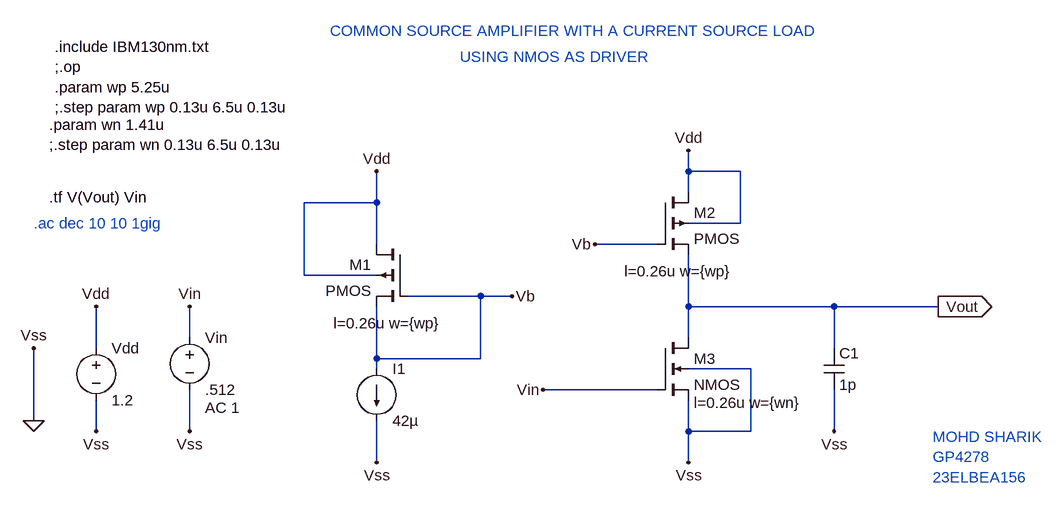
[diagram p0: schematic CSA_WITH_CURRENT_LOAD_ASSIGNMENT1.asc]
CSA_WITH_CURRENT_LOAD_ASSIGNMENT1.asc, the LTspice schematic file:
Version 4
SHEET 1 1208 680
WIRE 528 -112 528 -144
WIRE 608 -112 528 -112
WIRE 528 -80 528 -112
WIRE 48 -64 48 -112
WIRE 48 -64 -64 -64
WIRE 608 -32 608 -112
WIRE 608 -32 528 -32
WIRE 48 0 48 -64
WIRE 480 0 384 0
WIRE -64 48 -64 -64
WIRE 48 48 -64 48
WIRE 208 80 96 80
WIRE 256 80 208 80
WIRE 528 96 528 16
WIRE 752 96 528 96
WIRE 912 96 752 96
WIRE -240 144 -240 96
WIRE 528 144 528 96
WIRE -384 160 -384 96
WIRE 752 160 752 96
WIRE 48 176 48 96
WIRE 208 176 208 80
WIRE 208 176 48 176
WIRE 48 192 48 176
WIRE 624 192 528 192
WIRE 480 224 304 224
WIRE -480 272 -480 160
WIRE -384 288 -384 240
WIRE -240 288 -240 224
WIRE 528 288 528 240
WIRE 624 288 624 192
WIRE 624 288 528 288
WIRE 752 288 752 224
WIRE 48 336 48 272
WIRE 528 336 528 288
FLAG -480 272 0
FLAG 48 -112 Vdd
FLAG -384 96 Vdd
FLAG -480 160 Vss
FLAG -384 288 Vss
FLAG 48 336 Vss
FLAG 256 80 Vb
FLAG 752 288 Vss
FLAG 528 336 Vss
FLAG 912 96 Vout
IOPIN 912 96 Out
FLAG 384 0 Vb
FLAG 304 224 Vin
FLAG 528 -144 Vdd
FLAG -240 288 Vss
FLAG -240 96 Vin
SYMBOL pmos4 96 0 M0
WINDOW 123 -51 122 Left 2
SYMATTR Value2 l=0.26u w={wp}
SYMATTR InstName M1
SYMBOL current 48 192 R0
WINDOW 123 0 0 Left 0
WINDOW 39 0 0 Left 0
SYMATTR InstName I1
SYMATTR Value 42µ
SYMBOL voltage -384 144 R0
WINDOW 123 0 0 Left 0
WINDOW 39 0 0 Left 0
SYMATTR InstName Vdd
SYMATTR Value 1.2
SYMBOL pmos4 480 -80 R0
WINDOW 123 -51 122 Left 2
SYMATTR Value2 l=0.26u w={wp}
SYMATTR InstName M2
SYMBOL nmos4 480 144 R0
WINDOW 123 56 100 Left 2
SYMATTR Value2 l=0.26u w={wn}
SYMATTR InstName M3
SYMBOL cap 736 160 R0
SYMATTR InstName C1
SYMATTR Value 1p
SYMBOL voltage -240 128 R0
WINDOW 123 24 124 Left 2
WINDOW 39 0 0 Left 0
SYMATTR Value2 AC 1
SYMATTR InstName Vin
SYMATTR Value .512
TEXT -448 -304 Left 2 !.include IBM130nm.txt\n;.op\n.param wp 5.25u\n;.step param wp 0.13u 6.5u 0.13u
TEXT -456 -184 Left 2 !.param wn 1.41u\n;.step param wn 0.13u 6.5u 0.13u
TEXT 904 296 Left 2 ;MOHD SHARIK\nGP4278\n23ELBEA156
TEXT -24 -328 Left 2 ;COMMON SOURCE AMPLIFIER WITH A CURRENT SOURCE LOAD
TEXT 176 -288 Left 2 ;USING NMOS AS DRIVER
TEXT -480 -32 Left 2 ;.ac dec 10 10 1gig
TEXT -456 -72 Left 2 !.tf V(Vout) Vin

The netlist it stands for:
* CSA_WITH_CURRENT_LOAD_ASSIGNMENT1.asc
M1 Vdd Vb Vb Vdd PMOS l=0.26u w={wp}
I1 Vb 0 42µ
Vdd Vdd 0 1.2
M2 Vdd Vb Vout Vdd PMOS l=0.26u w={wp}
M3 Vout Vin 0 0 NMOS l=0.26u w={wn}
C1 Vout 0 1p
Vin Vin 0 .512 AC 1
.model NMOS NMOS
.model PMOS PMOS
.lib standard.mos
.include IBM130nm.txt
;.op
.param wp 5.25u
;.step param wp 0.13u 6.5u 0.13u
.param wn 1.41u
;.step param wn 0.13u 6.5u 0.13u
* MOHD SHARIK
* GP4278
* 23ELBEA156
* COMMON SOURCE AMPLIFIER WITH A CURRENT SOURCE LOAD
* USING NMOS AS DRIVER
* .ac dec 10 10 1gig
.tf V(Vout) Vin
.backanno
.end